# EAGLE design SMA_Alignment_Jig (EAGLE 9.6.2)
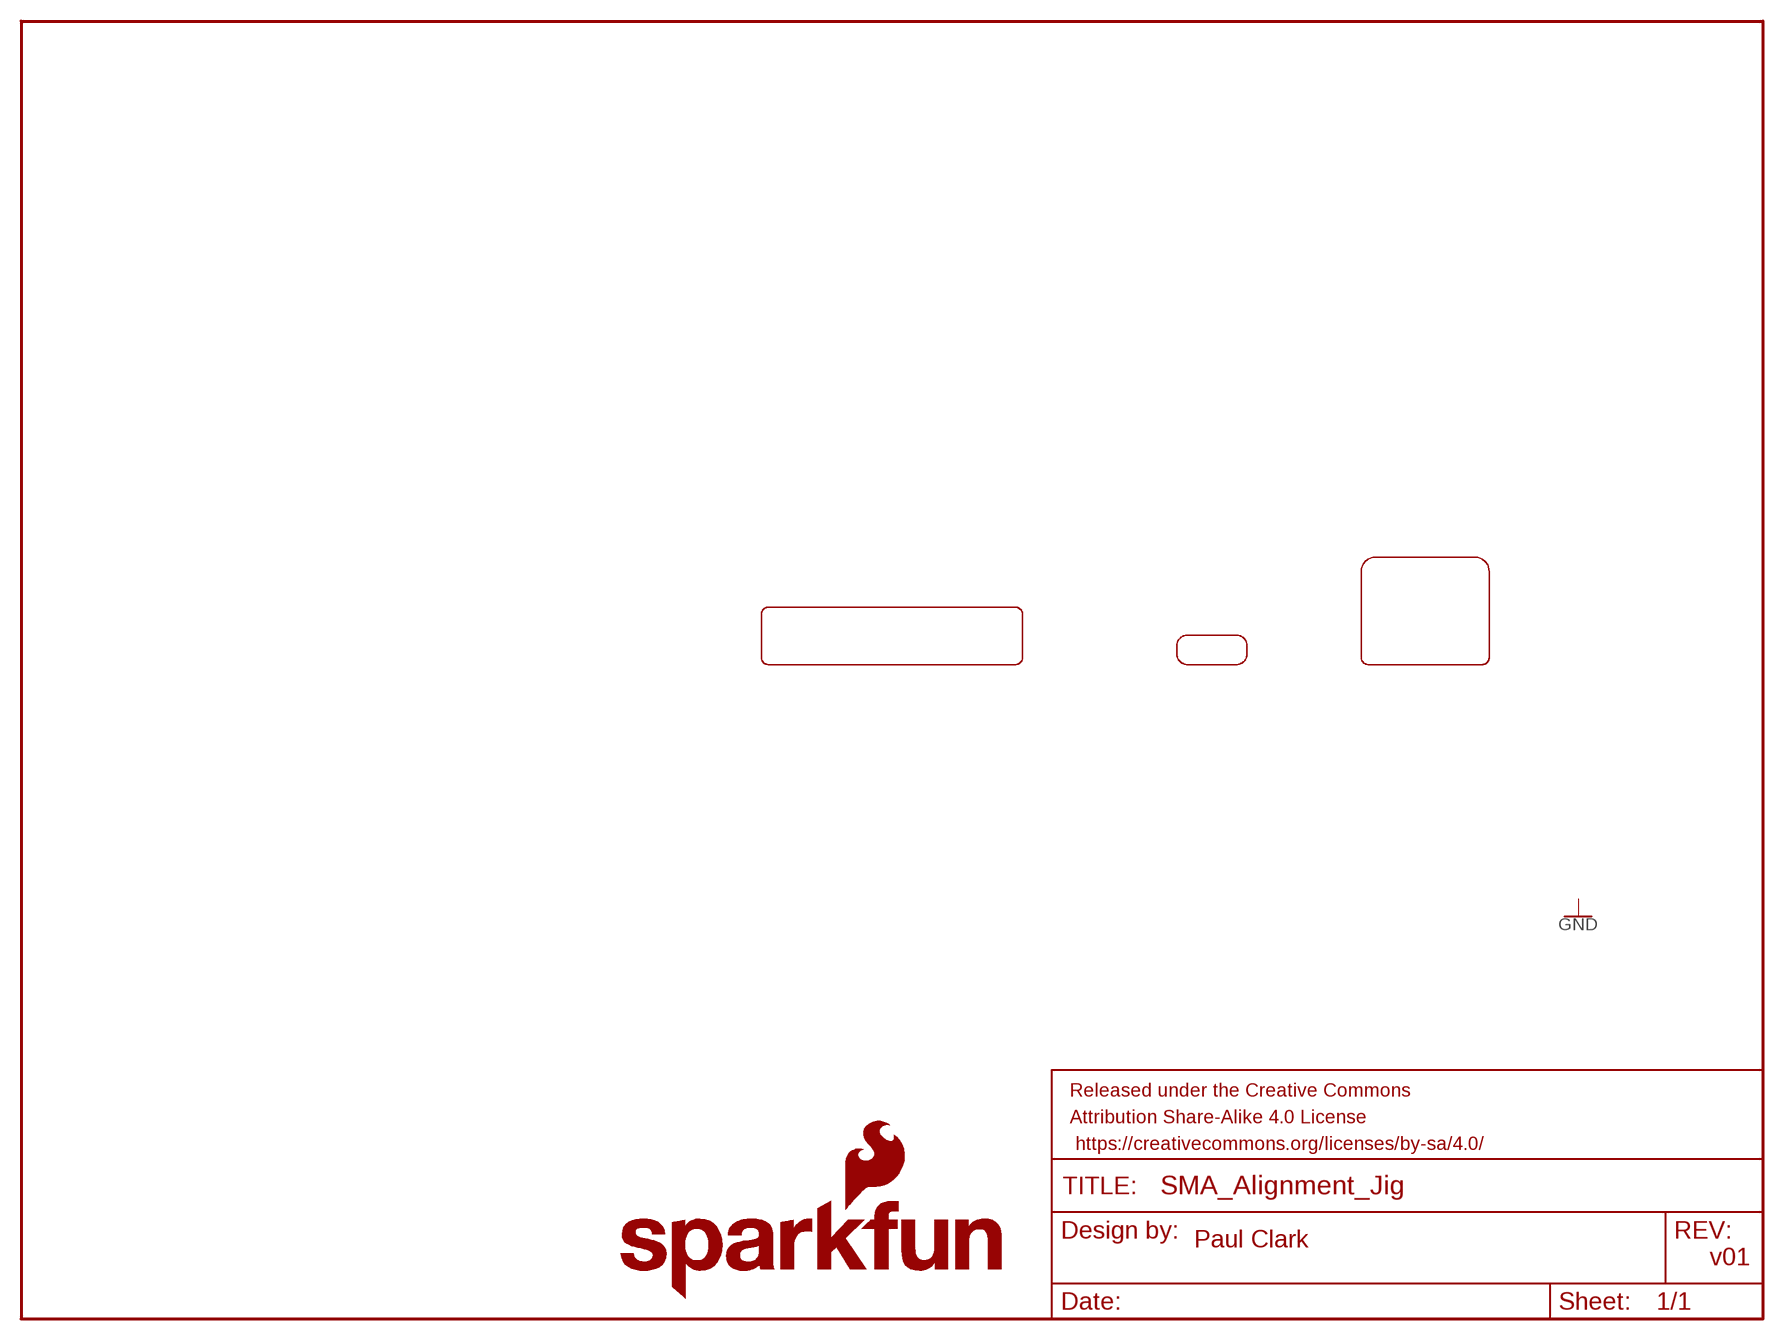
[diagram p0: schematic, sheet 1]

## Parts
FRAME1  FRAME-LETTER  [CREATIVE_COMMONS]
LOGO1  SFE_LOGO_NAME_FLAME.3_INCH  [SFE_LOGO_NAME_FLAME_.3]
U$2  3.5MM_CONNECTOR  [3.5MM_CONNECTOR]
U$3  USB-C  [USB-C]
U$4  ETHERNET  [ETHERNET]

## Notes on the sheet
- Paul Clark
- v01

## Library data of the parts
FRAME1 = SparkFun-Aesthetics:FRAME-LETTER: Schematic Frame - Letter Standard 8.5x11 US Letter frame
LOGO1 = SparkFun-Aesthetics:SFE_LOGO_NAME_FLAME: SparkFun Font Logo w/ Flame This is the SparkFun full logo. The logo on the schematic will always be the same size; the package variant is the height of the flame part of the logo. Default layer for the logo on the board is tSilk.
U$2 = CORS_Panels:3.5MM_CONNECTOR
U$3 = CORS_Panels:USB-C
U$4 = CORS_Panels:ETHERNET

## Board
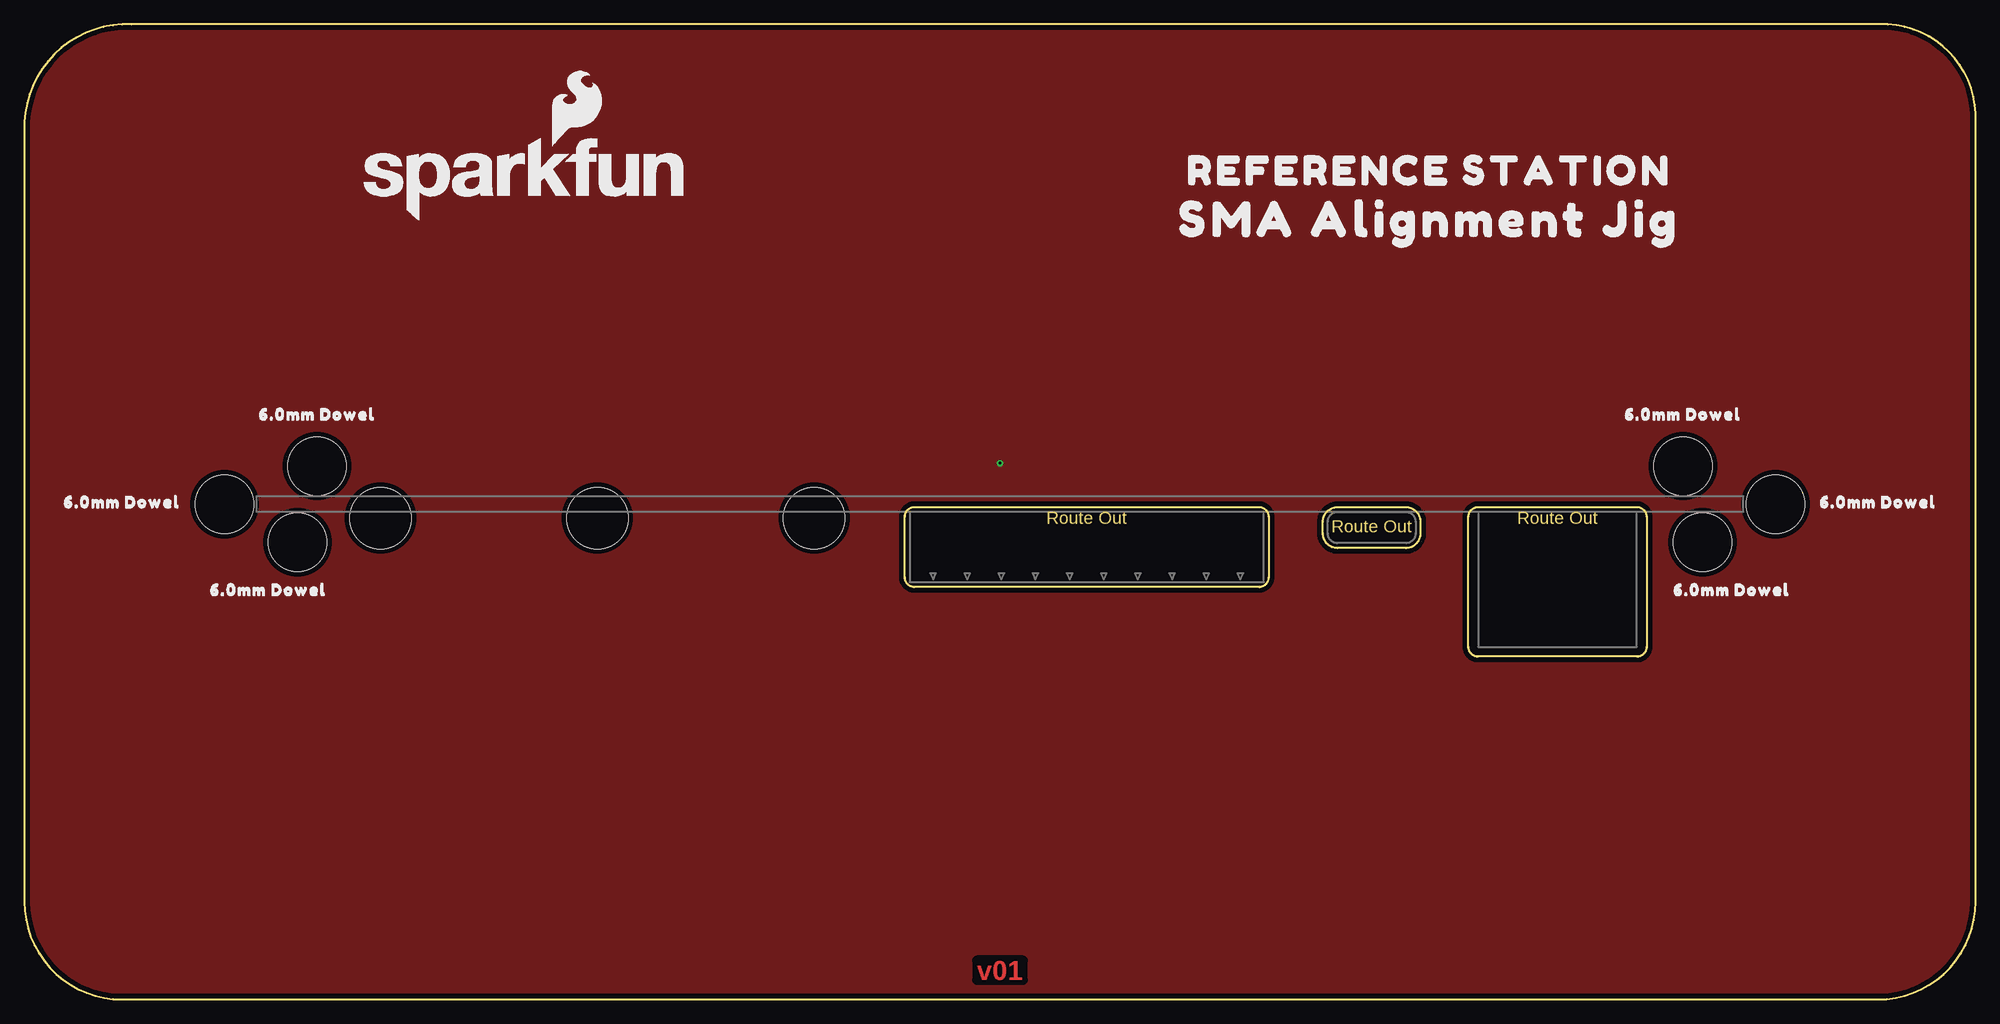
[diagram p1: board, top side]
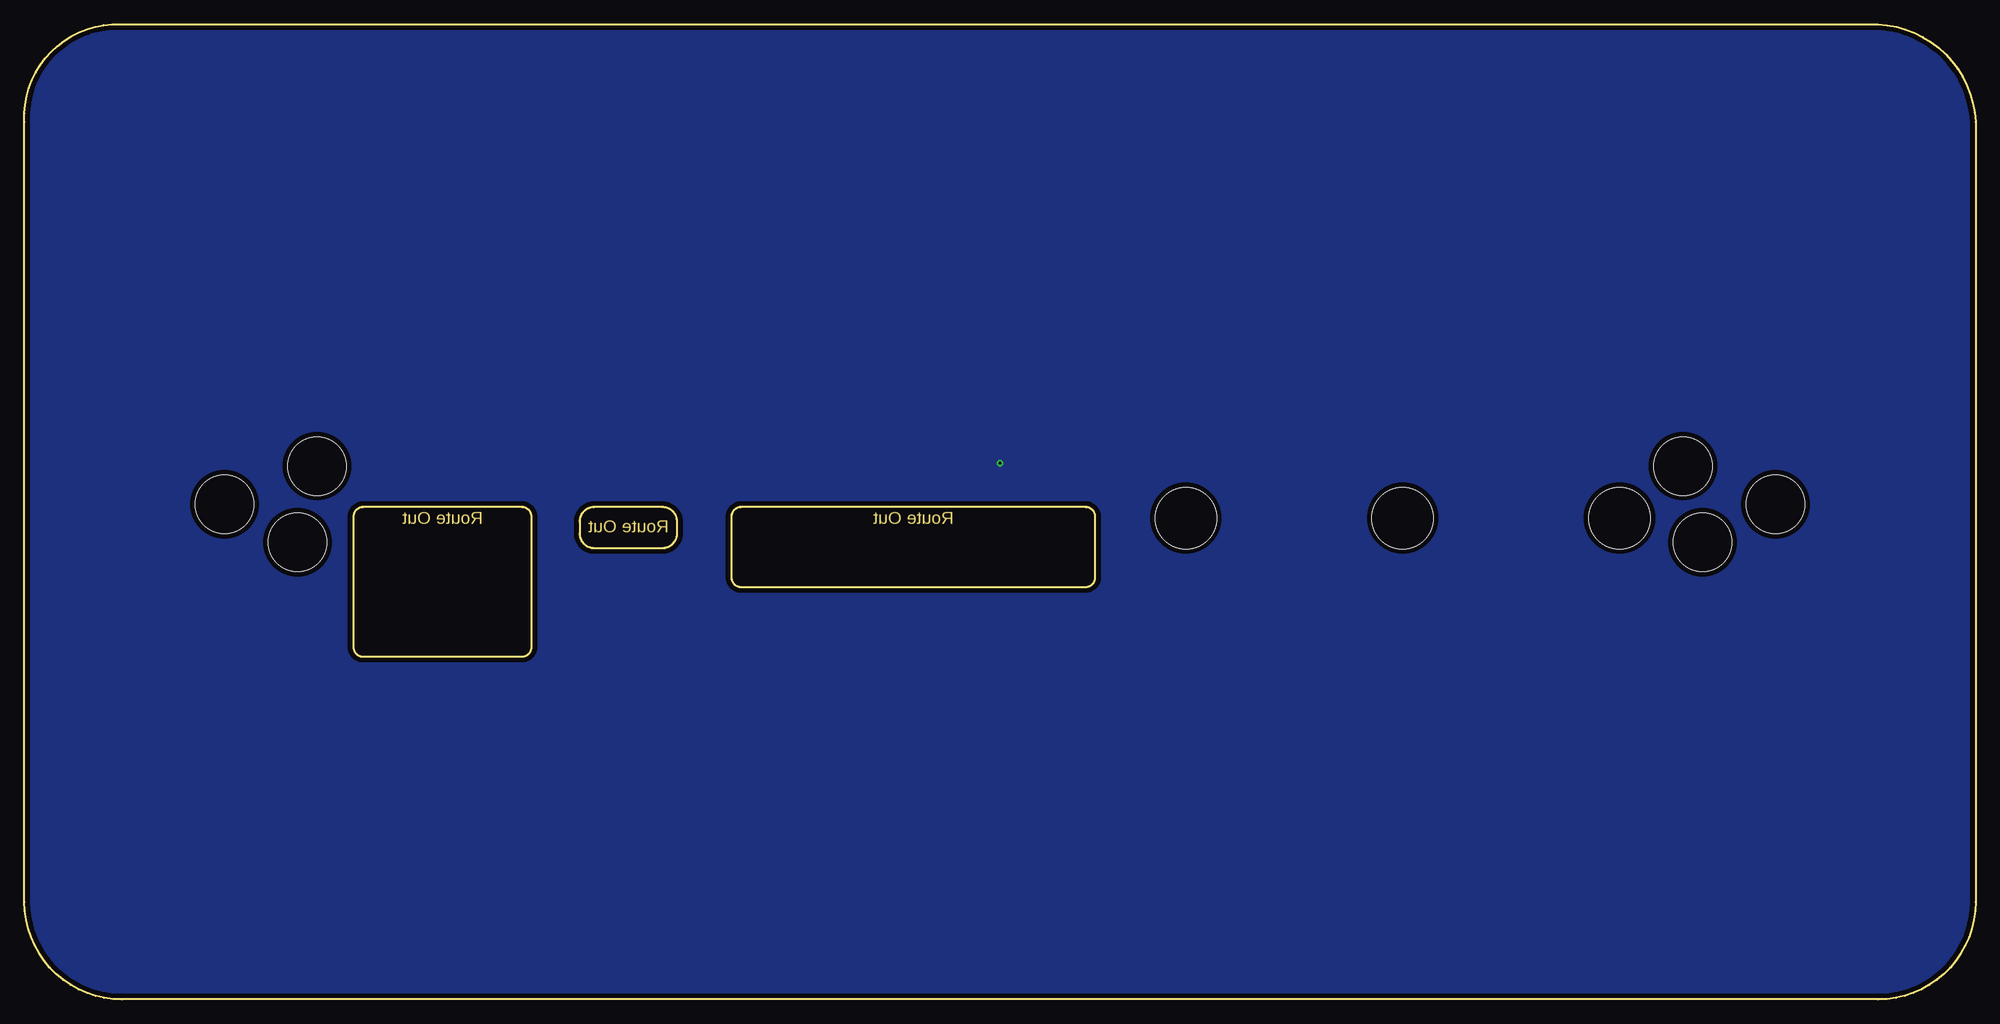
[diagram p2: board, bottom side, seen from below]

Size 200.01 x 100 mm. Coordinates in mm from the lower left corner, seen from the top.
Outline: 0,10 arc90 10,0 190,0 arc90 200,10 200,90 arc90 191,100 11,100 arc90 0,90 0,10
Copper layers (1*16): Top 0.035mm / dielectric 1.5mm / Bottom 0.035mm
Design rules "SparkFun-2-Layer-General-JLCPCB": minimum track width 7mil, minimum drill 0.3mm, track to track 7mil, track to pad 7mil, pad to pad 7mil, via to via 7mil, smd to smd 7mil, copper to edge 7mil, drill to drill 7mil, minimum pad ring 7mil, minimum via ring 7mil, stop-mask expansion 3mil, vias tented up to drill 25mil, thermal gap 10mil
Holes 6 mm at 20.5,50.8 179.5,50.8 28,46.9 30,54.7 170,54.7 172,46.9
Holes 6.3 mm at 80.95,49.37 58.73,49.37 36.5,49.37

### Placement (x,y rotation side)
FRAME1  75,-9 0 top  (outside the outline)
LOGO1  51.15,84.09 0 top
U$1  [REFERENCE_STATION0]  144,85 0 top
U$2  108.89,50 180 top
U$3  138.1,50 180 top
U$4  157.15,50 180 top
U$5  [SMA_ALIGNMENT_JIG0]  144,80 0 top
U$6  [6#0MM_DOWEL0]  170,60 0 top
U$7  [6#0MM_DOWEL0]  190,51 0 top
U$8  [6#0MM_DOWEL0]  175,42 0 top
U$9  [6#0MM_DOWEL0]  25,42 0 top
U$10  [6#0MM_DOWEL0]  10,51 0 top
U$11  [6#0MM_DOWEL0]  30,60 0 top

### Tracks (layer width: path | path; a pad name or v marks a point on that pad's centre or on a via)
GND  (via drill 0.3)
  other vias: 100,55
  pour Top (isolate 0.5, no thermals): 0,100 200,100 200,0 0,0
  pour Bottom (isolate 0.5, no thermals): 0,100 200,100 200,0 0,0

### Text on the board
Top: v01